# Altium schematic sheet SAMA7D65_PIO.SchDoc
size A3; SheetNumber: 8; SheetTotal: 23
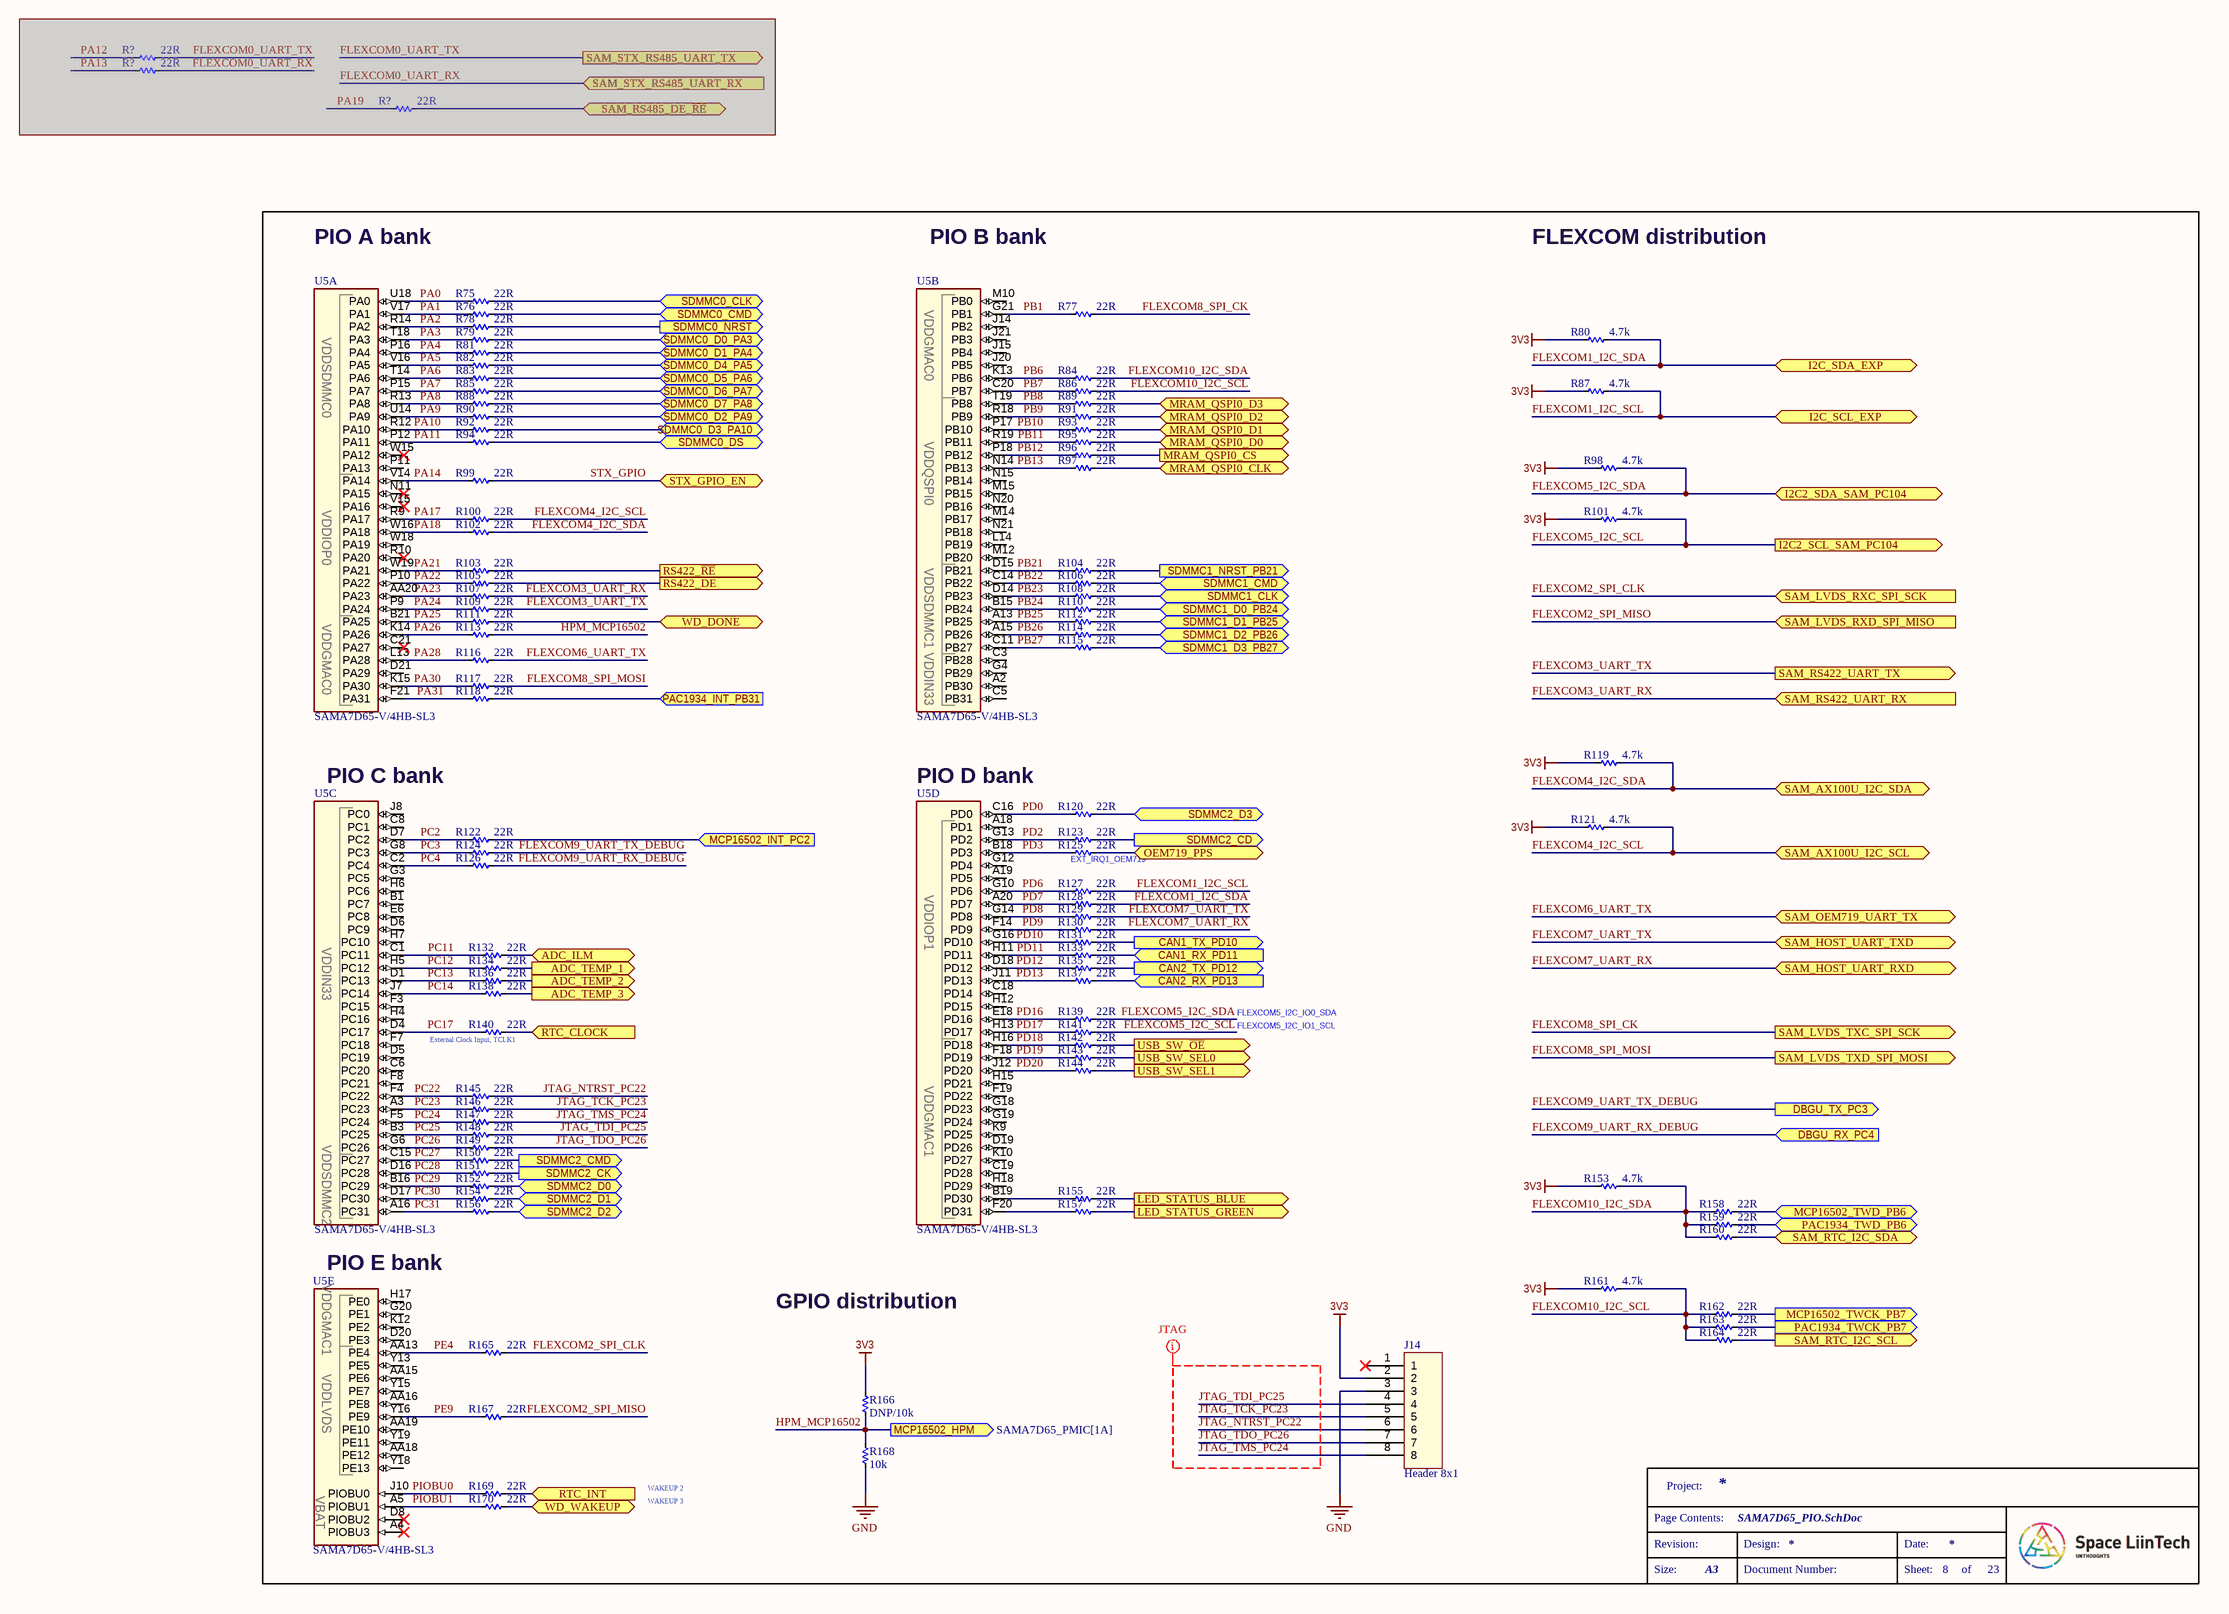
[diagram p0: SAMA7D65_PIO.SchDoc]

## Parts
(Parts that share a designator on the sheet are numbered #1, #2 ... from top to bottom, then left to right.)
J14  Header 8x1  [Header_254P_8x1]
R75  22R  [RES_C_0603X30]
R76  22R  [RES_C_0603X30]
R77  22R  [RES_C_0603X30]
R78  22R  [RES_C_0603X30]
R79  22R  [RES_C_0603X30]
R80  4.7k  [RES_C_1005x30_L]
R81  22R  [RES_C_0603X30]
R82  22R  [RES_C_0603X30]
R83  22R  [RES_C_0603X30]
R84  22R  [RES_C_0603X30]
R85  22R  [RES_C_0603X30]
R86  22R  [RES_C_0603X30]
R87  4.7k  [RES_C_1005x30_L]
R88  22R  [RES_C_0603X30]
R89  22R  [RES_C_0603X30]
R90  22R  [RES_C_0603X30]
R91  22R  [RES_C_0603X30]
R92  22R  [RES_C_0603X30]
R93  22R  [RES_C_0603X30]
R94  22R  [RES_C_0603X30]
R95  22R  [RES_C_0603X30]
R96  22R  [RES_C_0603X30]
R97  22R  [RES_C_0603X30]
R98  4.7k  [RES_C_1005x30_L]
R99  22R  [RES_C_0603X30]
R100  22R  [RES_C_0603X30]
R101  4.7k  [RES_C_1005x30_L]
R102  22R  [RES_C_0603X30]
R103  22R  [RES_C_0603X30]
R104  22R  [RES_C_0603X30]
R105  22R  [RES_C_0603X30]
R106  22R  [RES_C_0603X30]
R107  22R  [RES_C_0603X30]
R108  22R  [RES_C_0603X30]
R109  22R  [RES_C_0603X30]
R110  22R  [RES_C_0603X30]
R111  22R  [RES_C_0603X30]
R112  22R  [RES_C_0603X30]
R113  22R  [RES_C_0603X30]
R114  22R  [RES_C_0603X30]
R115  22R  [RES_C_0603X30]
R116  22R  [RES_C_0603X30]
R117  22R  [RES_C_0603X30]
R118  22R  [RES_C_0603X30]
R119  4.7k  [RES_C_1005x30_L]
R120  22R  [RES_C_0603X30]
R121  4.7k  [RES_C_1005x30_L]
R122  22R  [RES_C_0603X30]
R123  22R  [RES_C_0603X30]
R124  22R  [RES_C_0603X30]
R125  22R  [RES_C_0603X30]
R126  22R  [RES_C_0603X30]
R127  22R  [RES_C_0603X30]
R128  22R  [RES_C_0603X30]
R129  22R  [RES_C_0603X30]
R130  22R  [RES_C_0603X30]
R131  22R  [RES_C_0603X30]
R132  22R  [RES_C_0603X30]
R133  22R  [RES_C_0603X30]
R134  22R  [RES_C_0603X30]
R135  22R  [RES_C_0603X30]
R136  22R  [RES_C_0603X30]
R137  22R  [RES_C_0603X30]
R138  22R  [RES_C_0603X30]
R139  22R  [RES_C_0603X30]
R140  22R  [RES_C_0603X30]
R141  22R  [RES_C_0603X30]
R142  22R  [RES_C_0603X30]
R143  22R  [RES_C_0603X30]
R144  22R  [RES_C_0603X30]
R145  22R  [RES_C_0603X30]
R146  22R  [RES_C_0603X30]
R147  22R  [RES_C_0603X30]
R148  22R  [RES_C_0603X30]
R149  22R  [RES_C_0603X30]
R150  22R  [RES_C_0603X30]
R151  22R  [RES_C_0603X30]
R152  22R  [RES_C_0603X30]
R153  4.7k  [RES_C_1005x30_L]
R154  22R  [RES_C_0603X30]
R155  22R  [RES_C_0603X30]
R156  22R  [RES_C_0603X30]
R157  22R  [RES_C_0603X30]
R158  22R  [RES_C_0603X30]
R159  22R  [RES_C_0603X30]
R160  22R  [RES_C_0603X30]
R161  4.7k  [RES_C_1005x30_L]
R162  22R  [RES_C_0603X30]
R163  22R  [RES_C_0603X30]
R164  22R  [RES_C_0603X30]
R165  22R  [RES_C_0603X30]
R166  DNP/10k  [RES_C_1005x30_L]
R167  22R  [RES_C_0603X30]
R168  10k  [RES_C_1005x30_L]
R169  22R  [RES_C_0603X30]
R170  22R  [RES_C_0603X30]
R?#1  22R  [RES_C_0603X30]  (masked out: inside a compile mask, not in the netlist)
R?#2  22R  [RES_C_0603X30]  (masked out: inside a compile mask, not in the netlist)
R?#3  22R  [RES_C_0603X30]  (masked out: inside a compile mask, not in the netlist)
U5  value SAMA7D65-V/4HB-SL3  [TFBGA-343_14x14]  (hidden comment: SAMA7D65)  (parts A,B,C,D,E of 8)

## Ports
ADC_ILM (bidir, see POWER[6B]), ADC_TEMP_1 (out, see TEMP[5B]), ADC_TEMP_2 (out, see TEMP[5B]), ADC_TEMP_3 (out, see TEMP[5C]), CAN1_RX_PD11 (in, see CAN_PHY[3B]), CAN1_TX_PD10 (out, see CAN_PHY[3B]), CAN2_RX_PD13 (in, see CAN_PHY[3C]), CAN2_TX_PD12 (out, see CAN_PHY[3C]), DBGU_RX_PC4 (in, see DEBUG_CONSOLE[3C]), DBGU_TX_PC3 (out, see DEBUG_CONSOLE[3C]), I2C2_SCL_SAM_PC104 (out, see CONNECTOR_INTERFACE[4B]), I2C2_SDA_SAM_PC104 (bidir, see CONNECTOR_INTERFACE[4B]), I2C_SCL_EXP (bidir, see CONNECTOR_EXP[4C], CONNECTOR_INTERFACE[1D], CONNECTOR_INTERFACE[6B]), I2C_SDA_EXP (bidir, see CONNECTOR_EXP[4C], CONNECTOR_INTERFACE[1C], CONNECTOR_INTERFACE[6B]), LED_STATUS_BLUE (out, see BUTTON_LED[2B]), LED_STATUS_GREEN (out, see BUTTON_LED[2B]), MCP16502_HPM (out, see SAMA7D65_PMIC[1A]), MCP16502_INT_PC2 (in, see SAMA7D65_PMIC[1B]), MCP16502_TWCK_PB7 (out, see SAMA7D65_PMIC[1B]), MCP16502_TWD_PB6 (bidir, see SAMA7D65_PMIC[1B]), MRAM_QSPI0_CLK (bidir, see EEPROM[6C]), MRAM_QSPI0_CS (out, see EEPROM[3B]), MRAM_QSPI0_D0 (bidir, see EEPROM[6C]), MRAM_QSPI0_D1 (bidir, see EEPROM[3B]), MRAM_QSPI0_D2 (bidir, see EEPROM[3C]), MRAM_QSPI0_D3 (bidir, see EEPROM[6B]), OEM719_PPS (bidir, see CONNECTOR_INTERFACE[6B], CONNECTOR_INTERFACE[6D]), PAC1934_INT_PB31 (in, see SAMA7D65_PMIC[7B]), PAC1934_TWCK_PB7 (out, see SAMA7D65_PMIC[7B]), PAC1934_TWD_PB6 (bidir, see SAMA7D65_PMIC[7B]), RS422_DE (out, see RS422[1C]), RS422_~{RE} (out, see RS422[1B]), RTC_CLOCK (in, see RTC[6B]), RTC_INT (in, see RTC[6C]), SAM_AX100U_I2C_SCL (bidir, see CONNECTOR_INTERFACE[5C]), SAM_AX100U_I2C_SDA (bidir, see CONNECTOR_INTERFACE[7C]), SAM_HOST_UART_RXD (bidir, see CONNECTOR_INTERFACE[6D]), SAM_HOST_UART_TXD (bidir, see CONNECTOR_INTERFACE[7D]), SAM_LVDS_RXC_SPI_SCK (in, see LVDS[2C]), SAM_LVDS_RXD_SPI_MISO (in, see LVDS[2C]), SAM_LVDS_TXC_SPI_SCK (out, see LVDS[2B]), SAM_LVDS_TXD_SPI_MOSI (out, see LVDS[2A]), SAM_OEM719_UART_TX (bidir, see CONNECTOR_INTERFACE[4B], CONNECTOR_INTERFACE[7D]), SAM_RS422_UART_RX (in, see RS422[3B]), SAM_RS422_UART_TX (out, see RS422[3C]), SAM_RS485_DE_~{RE} (bidir), SAM_RTC_I2C_SCL (out, see RTC[3C]), SAM_RTC_I2C_SDA (bidir, see RTC[3C]), SAM_STX_RS485_UART_RX (in), SAM_STX_RS485_UART_TX (out), SDMMC0_CLK (bidir, see eMMC[2B]), SDMMC0_CMD (bidir, see eMMC[2B]), SDMMC0_D0_PA3 (bidir, see eMMC[2B]), SDMMC0_D1_PA4 (bidir, see eMMC[2B]), SDMMC0_D2_PA9 (bidir, see eMMC[2B]), SDMMC0_D3_PA10 (bidir, see eMMC[2B]), SDMMC0_D4_PA5 (bidir, see eMMC[2B]), SDMMC0_D5_PA6 (bidir, see eMMC[2B]), SDMMC0_D6_PA7 (bidir, see eMMC[2B]), SDMMC0_D7_PA8 (bidir, see eMMC[2B]), SDMMC0_DS (bidir, see eMMC[3B]), SDMMC0_NRST (out, see eMMC[3B]), SDMMC1_CLK (bidir, see eMMC[2C]), SDMMC1_CMD (bidir, see eMMC[2C]), SDMMC1_D0_PB24 (bidir, see eMMC[2C]), SDMMC1_D1_PB25 (bidir, see eMMC[2C]), SDMMC1_D2_PB26 (bidir, see eMMC[2D]), SDMMC1_D3_PB27 (bidir, see eMMC[2D]), SDMMC1_NRST_PB21 (out, see eMMC[3D]), SDMMC2_CD (out, see SDCARD[3B]), SDMMC2_CK (out, see SDCARD[3B]), SDMMC2_CMD (out, see SDCARD[3C]), SDMMC2_D0 (bidir, see SDCARD[3B]), SDMMC2_D1 (bidir, see SDCARD[3B]), SDMMC2_D2 (bidir, see SDCARD[3B]), SDMMC2_D3 (bidir, see SDCARD[3B]), STX_GPIO_EN (bidir, see CONNECTOR_INTERFACE[6A]), USB_SW_SEL0 (out, see USB_SWITCH[3C]), USB_SW_SEL1 (out, see USB_SWITCH[3C]), USB_SW_~{OE} (out, see USB_SWITCH[3B]), WD_DONE (bidir, see WATCHDOG[5B]), WD_WAKEUP (bidir, see WATCHDOG[5B])

## Nets
3V3: J14.2 R80.1 R87.1 R98.1 R101.1 R119.1 R121.1 R153.1 R161.1 R166.1
GND: J14.3 R168.2
ADC_ILM: R132.2 ; port ADC_ILM
ADC_TEMP_1: R134.2 ; port ADC_TEMP_1
ADC_TEMP_2: R136.2 ; port ADC_TEMP_2
ADC_TEMP_3: R138.2 ; port ADC_TEMP_3
CAN1_RX_PD11: R133.2 ; port CAN1_RX_PD11
CAN1_TX_PD10: R131.2 ; port CAN1_TX_PD10
CAN2_RX_PD13: R137.2 ; port CAN2_RX_PD13
CAN2_TX_PD12: R135.2 ; port CAN2_TX_PD12
FLEXCOM1_I2C_SCL: R87.2 R127.2 ; port I2C_SCL_EXP
FLEXCOM1_I2C_SDA: R80.2 R128.2 ; port I2C_SDA_EXP
FLEXCOM2_SPI_CLK: R165.2 ; port SAM_LVDS_RXC_SPI_SCK
FLEXCOM2_SPI_MISO: R167.2 ; port SAM_LVDS_RXD_SPI_MISO
FLEXCOM3_UART_RX: R107.2 ; port SAM_RS422_UART_RX
FLEXCOM3_UART_TX: R109.2 ; port SAM_RS422_UART_TX
FLEXCOM4_I2C_SCL: R100.2 R121.2 ; port SAM_AX100U_I2C_SCL
FLEXCOM4_I2C_SDA: R102.2 R119.2 ; port SAM_AX100U_I2C_SDA
FLEXCOM5_I2C_SCL: R101.2 R141.2 ; port I2C2_SCL_SAM_PC104
FLEXCOM5_I2C_SDA: R98.2 R139.2 ; port I2C2_SDA_SAM_PC104
FLEXCOM6_UART_TX: R116.2 ; port SAM_OEM719_UART_TX
FLEXCOM7_UART_RX: R130.2 ; port SAM_HOST_UART_RXD
FLEXCOM7_UART_TX: R129.2 ; port SAM_HOST_UART_TXD
FLEXCOM8_SPI_CK: R77.2 ; port SAM_LVDS_TXC_SPI_SCK
FLEXCOM8_SPI_MOSI: R117.2 ; port SAM_LVDS_TXD_SPI_MOSI
FLEXCOM9_UART_RX_DEBUG: R126.2 ; port DBGU_RX_PC4
FLEXCOM9_UART_TX_DEBUG: R124.2 ; port DBGU_TX_PC3
FLEXCOM10_I2C_SCL: R86.2 R161.2 R162.1 R163.1 R164.1
FLEXCOM10_I2C_SDA: R84.2 R153.2 R158.1 R159.1 R160.1
HPM_MCP16502: R113.2 R166.2 R168.1 ; port MCP16502_HPM
JTAG_NTRST_PC22: J14.6 R145.2
JTAG_TCK_PC23: J14.5 R146.2
JTAG_TDI_PC25: J14.4 R148.2
JTAG_TDO_PC26: J14.7 R149.2
JTAG_TMS_PC24: J14.8 R147.2
LED_STATUS_BLUE: R155.2 ; port LED_STATUS_BLUE
LED_STATUS_GREEN: R157.2 ; port LED_STATUS_GREEN
MCP16502_INT_PC2: R122.2 ; port MCP16502_INT_PC2
MCP16502_TWCK_PB7: R162.2 ; port MCP16502_TWCK_PB7
MCP16502_TWD_PB6: R158.2 ; port MCP16502_TWD_PB6
MRAM_QSPI0_CLK: R97.2 ; port MRAM_QSPI0_CLK
MRAM_QSPI0_CS: R96.2 ; port MRAM_QSPI0_CS
MRAM_QSPI0_D0: R95.2 ; port MRAM_QSPI0_D0
MRAM_QSPI0_D1: R93.2 ; port MRAM_QSPI0_D1
MRAM_QSPI0_D2: R91.2 ; port MRAM_QSPI0_D2
MRAM_QSPI0_D3: R89.2 ; port MRAM_QSPI0_D3
OEM719_PPS: R125.2 ; port OEM719_PPS
PA0: R75.1 U5.U18(PA0)
PA1: R76.1 U5.V17(PA1)
PA2: R78.1 U5.R14(PA2)
PA3: R79.1 U5.T18(PA3)
PA4: R81.1 U5.P16(PA4)
PA5: R82.1 U5.V16(PA5)
PA6: R83.1 U5.T14(PA6)
PA7: R85.1 U5.P15(PA7)
PA8: R88.1 U5.R13(PA8)
PA9: R90.1 U5.U14(PA9)
PA10: R92.1 U5.R12(PA10)
PA11: R94.1 U5.P12(PA11)
PA14: R99.1 U5.V14(PA14)
PA17: R100.1 U5.R9(PA17)
PA18: R102.1 U5.W16(PA18)
PA21: R103.1 U5.W19(PA21)
PA22: R105.1 U5.P10(PA22)
PA23: R107.1 U5.AA20(PA23)
PA24: R109.1 U5.P9(PA24)
PA25: R111.1 U5.B21(PA25)
PA26: R113.1 U5.K14(PA26)
PA28: R116.1 U5.L13(PA28)
PA30: R117.1 U5.K15(PA30)
PA31: R118.1 U5.F21(PA31)
PAC1934_INT_PB31: R118.2 ; port PAC1934_INT_PB31
PAC1934_TWCK_PB7: R163.2 ; port PAC1934_TWCK_PB7
PAC1934_TWD_PB6: R159.2 ; port PAC1934_TWD_PB6
PB1: R77.1 U5.G21(PB1)
PB6: R84.1 U5.K13(PB6)
PB7: R86.1 U5.C20(PB7)
PB8: R89.1 U5.T19(PB8)
PB9: R91.1 U5.R18(PB9)
PB10: R93.1 U5.P17(PB10)
PB11: R95.1 U5.R19(PB11)
PB12: R96.1 U5.P18(PB12)
PB13: R97.1 U5.N14(PB13)
PB21: R104.1 U5.D15(PB21)
PB22: R106.1 U5.C14(PB22)
PB23: R108.1 U5.D14(PB23)
PB24: R110.1 U5.B15(PB24)
PB25: R112.1 U5.A13(PB25)
PB26: R114.1 U5.A15(PB26)
PB27: R115.1 U5.C11(PB27)
PC2: R122.1 U5.D7(PC2)
PC3: R124.1 U5.G8(PC3)
PC4: R126.1 U5.C2(PC4)
PC11: R132.1 U5.C1(PC11)
PC12: R134.1 U5.H5(PC12)
PC13: R136.1 U5.D1(PC13)
PC14: R138.1 U5.J7(PC14)
PC17: R140.1 U5.D4(PC17)
PC22: R145.1 U5.F4(PC22)
PC23: R146.1 U5.A3(PC23)
PC24: R147.1 U5.F5(PC24)
PC25: R148.1 U5.B3(PC25)
PC26: R149.1 U5.G6(PC26)
PC27: R150.1 U5.C15(PC27)
PC28: R151.1 U5.D16(PC28)
PC29: R152.1 U5.B16(PC29)
PC30: R154.1 U5.D17(PC30)
PC31: R156.1 U5.A16(PC31)
PD0: R120.1 U5.C16(PD0)
PD2: R123.1 U5.G13(PD2)
PD3: R125.1 U5.B18(PD3)
PD6: R127.1 U5.G10(PD6)
PD7: R128.1 U5.A20(PD7)
PD8: R129.1 U5.G14(PD8)
PD9: R130.1 U5.F14(PD9)
PD10: R131.1 U5.G16(PD10)
PD11: R133.1 U5.H11(PD11)
PD12: R135.1 U5.D18(PD12)
PD13: R137.1 U5.J11(PD13)
PD16: R139.1 U5.E18(PD16)
PD17: R141.1 U5.H13(PD17)
PD18: R142.1 U5.H16(PD18)
PD19: R143.1 U5.F18(PD19)
PD20: R144.1 U5.J12(PD20)
PE4: R165.1 U5.AA13(PE4)
PE9: R167.1 U5.Y16(PE9)
PIOBU0: R169.1 U5.J10(PIOBU0)
PIOBU1: R170.1 U5.A5(PIOBU1)
RS422_DE: R105.2 ; port RS422_DE
RS422_~{RE}: R103.2 ; port RS422_~{RE}
RTC_CLOCK: R140.2 ; port RTC_CLOCK
RTC_INT: R169.2 ; port RTC_INT
SAM_RTC_I2C_SCL: R164.2 ; port SAM_RTC_I2C_SCL
SAM_RTC_I2C_SDA: R160.2 ; port SAM_RTC_I2C_SDA
SDMMC0_CLK: R75.2 ; port SDMMC0_CLK
SDMMC0_CMD: R76.2 ; port SDMMC0_CMD
SDMMC0_D0_PA3: R79.2 ; port SDMMC0_D0_PA3
SDMMC0_D1_PA4: R81.2 ; port SDMMC0_D1_PA4
SDMMC0_D2_PA9: R90.2 ; port SDMMC0_D2_PA9
SDMMC0_D3_PA10: R92.2 ; port SDMMC0_D3_PA10
SDMMC0_D4_PA5: R82.2 ; port SDMMC0_D4_PA5
SDMMC0_D5_PA6: R83.2 ; port SDMMC0_D5_PA6
SDMMC0_D6_PA7: R85.2 ; port SDMMC0_D6_PA7
SDMMC0_D7_PA8: R88.2 ; port SDMMC0_D7_PA8
SDMMC0_DS: R94.2 ; port SDMMC0_DS
SDMMC0_NRST: R78.2 ; port SDMMC0_NRST
SDMMC1_CLK: R108.2 ; port SDMMC1_CLK
SDMMC1_CMD: R106.2 ; port SDMMC1_CMD
SDMMC1_D0_PB24: R110.2 ; port SDMMC1_D0_PB24
SDMMC1_D1_PB25: R112.2 ; port SDMMC1_D1_PB25
SDMMC1_D2_PB26: R114.2 ; port SDMMC1_D2_PB26
SDMMC1_D3_PB27: R115.2 ; port SDMMC1_D3_PB27
SDMMC1_NRST_PB21: R104.2 ; port SDMMC1_NRST_PB21
SDMMC2_CD: R123.2 ; port SDMMC2_CD
SDMMC2_CK: R151.2 ; port SDMMC2_CK
SDMMC2_CMD: R150.2 ; port SDMMC2_CMD
SDMMC2_D0: R152.2 ; port SDMMC2_D0
SDMMC2_D1: R154.2 ; port SDMMC2_D1
SDMMC2_D2: R156.2 ; port SDMMC2_D2
SDMMC2_D3: R120.2 ; port SDMMC2_D3
STX_GPIO: R99.2 ; port STX_GPIO_EN
USB_SW_~{OE}: R142.2 ; port USB_SW_~{OE}
USB_SW_SEL0: R143.2 ; port USB_SW_SEL0
USB_SW_SEL1: R144.2 ; port USB_SW_SEL1
WD_DONE: R111.2 ; port WD_DONE
WD_WAKEUP: R170.2 ; port WD_WAKEUP
NetR155_1: R155.1 U5.B19(PD30)
NetR157_1: R157.1 U5.F20(PD31)

Not connected (* = marked no-connect by the designer): J14 1*; U5 A2(PB30) A4(PIOBU3)* A18(PD1) A19(PD5) AA15(PE6) AA16(PE8) AA18(PE12) AA19(PE10) B1(PC7) C3(PB28) C5(PB31) C6(PC20) C8(PC1) C18(PD14) C19(PD28) C21(PA27)* D5(PC19) D6(PC9) D8(PIOBU2)* D19(PD26) D20(PE3) D21(PA29) E6(PC8) F3(PC15) F7(PC18) F8(PC21) F19(PD22) G3(PC5) G4(PB29) G12(PD4) G18(PD23) G19(PD24) G20(PE1) H4(PC16) H6(PC6) H7(PC10) H12(PD15) H15(PD21) H17(PE0) H18(PD29) J8(PC0) J14(PB2) J15(PB4) J20(PB5) J21(PB3) K9(PD25) K10(PD27) K12(PE2) L14(PB19) M10(PB0) M12(PB20) M14(PB17) M15(PB15) N11(PA15)* N15(PB14) N20(PB16) N21(PB18) P11(PA13) R10(PA20)* V15(PA16)* W15(PA12)* W18(PA19) Y13(PE5) Y15(PE7) Y18(PE13) Y19(PE11)

## Layout directives
net class JTAG; rule Matched Net Lengths [Tolerance = 2mm]: JTAG_NTRST_PC22, JTAG_TCK_PC23, JTAG_TDI_PC25, JTAG_TDO_PC26, JTAG_TMS_PC24

## Notes on the sheet
- PIO A bank
- PIO B bank
- FLEXCOM distribution
- (near U5) PIO C bank
- (near U5) PIO D bank
- (near R125) EXT_IRQ1_OEM719
- (near R140) External Clock Input, TCLK1
- FLEXCOM5_I2C_IO0_SDA
- FLEXCOM5_I2C_IO1_SCL
- (near U5) PIO E bank
- GPIO distribution
- WAKEUP 2
- WAKEUP 3
- Project:
- Page Contents:
- Revision:
- Design:
- Date:
- Size:
- A3
- Document Number:
- Sheet:
- of

## Library data of the parts
R75-R170 R?#1-R?#3 = _RES_B_2: RES
U5 = SAMA7D65: SAMA7D65 MPU 1000MHz Cortex-A7 TFBGA-343; Manufacturer 1: Microchip Technology; Description_: MCHP MPU 32-BIT Cortex-A7 1000MHz 128kB SAMA7D65-V/4HB-SL3 TFBGA-343; Populated: YES; MCHP-ID: IC2674; Symbol: SAMA7D65-TFBGA-343; Dev Tools Status: Design; Owner: Ciprian Abramov; Restricted Sourcing: No; Manufacturer Part Number 1: SAMA7D65-V/4HB-SL3; Type: 32-Bit MPU; Status: MCL Design; Revision: 1; Category: MCHP-Microcontroller; ComponentLink1URL: https://www.microchip.com/sitesearch/search/Product%20and%20Development%20Tools/SAMA7D65-V/4HB-SL3; ComponentLink1Description: SVN Datasheet; ComponentLink2Description: Local Datasheet; ComponentLink3URL: C:\ALTIUM_WORK\00001_MCHP-CDB\Library\LibraryRefs\SAMA7D65-TFBGA-343.SchLib; ComponentLink3Description: Open Symbol; ComponentLink4URL: C:\ALTIUM_WORK\00001_MCHP-CDB\Library\Footprints\TFBGA-343_14x14.PcbLib; ComponentLink4Description: Open Footprint; ComponentLink5Description: Open Footprint 2; ComponentLink6Description: Open Footprint 3; ComponentLink7Description: Open Footprint 4; Supplier 1: Microchip Technology; Supplier Part Number 1: SAMA7D65-V/4HB-SL3; Operating Temperature: -40C to +105C; Quantity Override: 1